# EasyEDA schematic dldpad_schematic.json
TITLE: Sheet_1; REV: 1.0; Date: 2025-02-01; Sheet: 1/1; Drawn By: tabletonly28; Company: Your Company
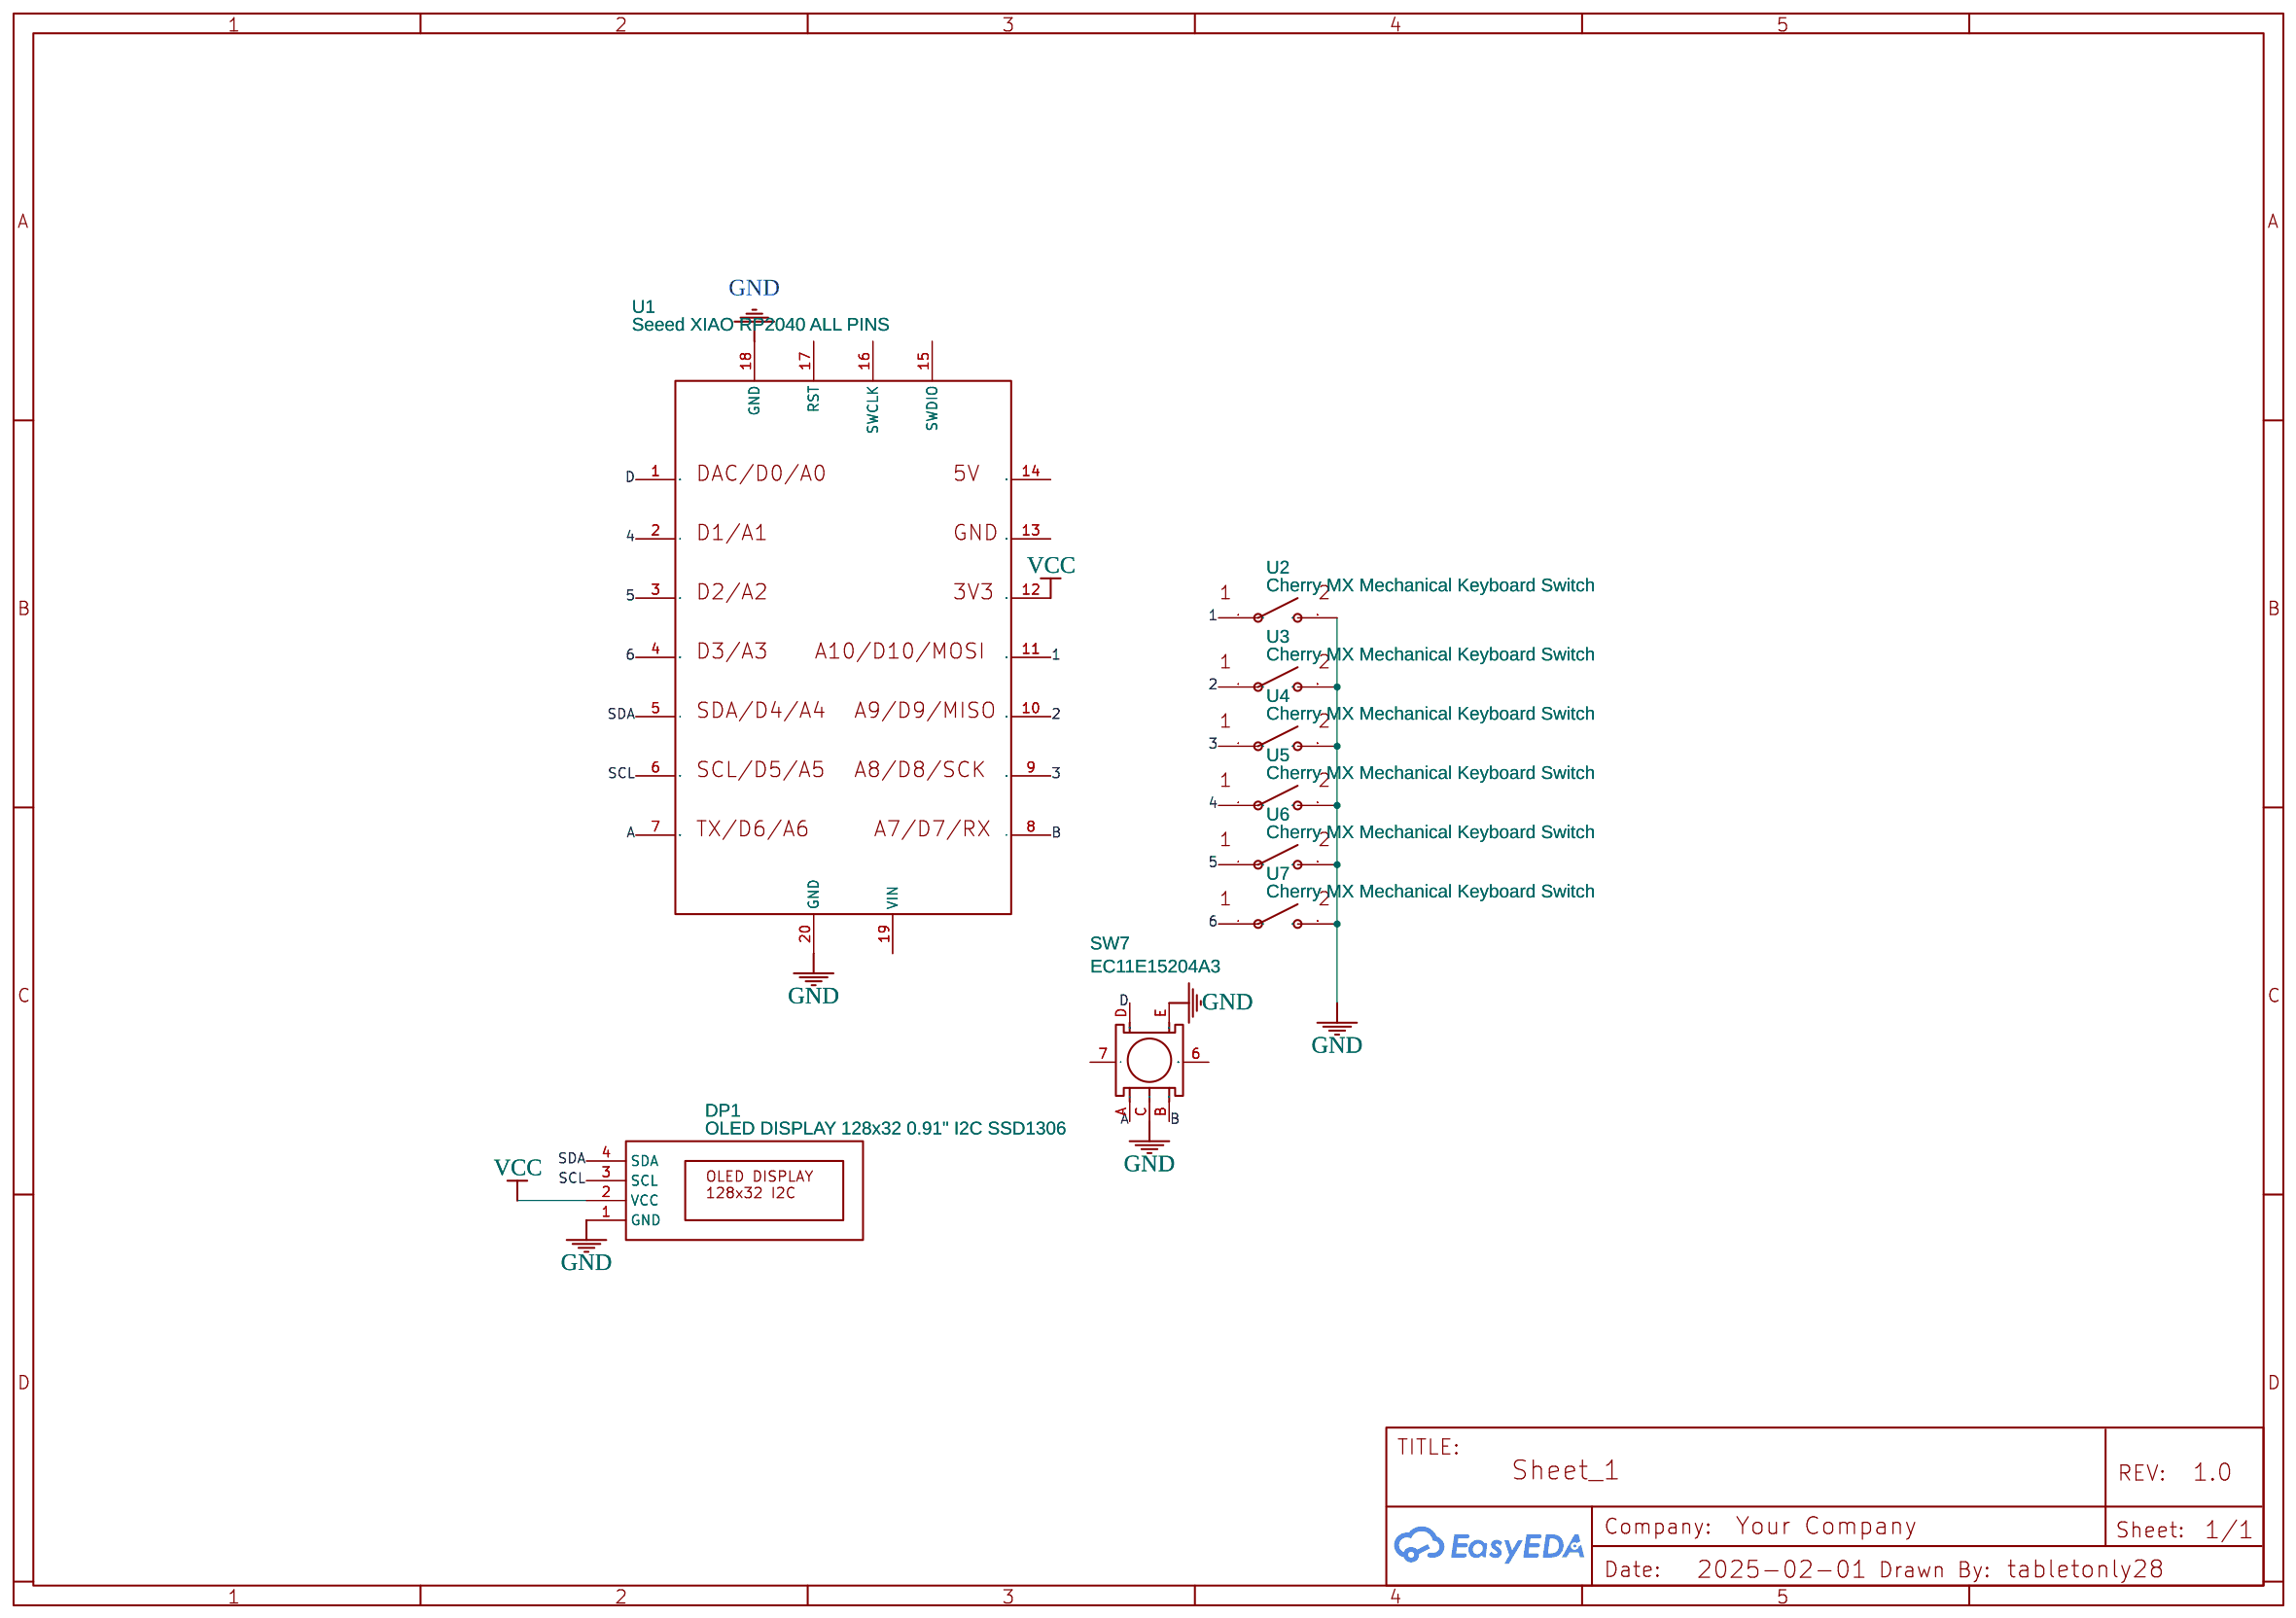
[diagram p0: schematic sheet]

## Parts
DP1  OLED DISPLAY 128x32 0.91" I2C SSD1306  [OLED-TH-C128-R64-D0.91-I2C-SSD1306]
SW7  EC11E15204A3  [SW-TH_EC11XXXXXXXX]
U1  Seeed XIAO RP2040 ALL PINS  [SEEED XIAO RP2040]
U2  Cherry MX Mechanical Keyboard Switch  [CHERRY MX KEYSWITCH]
U3  Cherry MX Mechanical Keyboard Switch  [CHERRY MX KEYSWITCH]
U4  Cherry MX Mechanical Keyboard Switch  [CHERRY MX KEYSWITCH]
U5  Cherry MX Mechanical Keyboard Switch  [CHERRY MX KEYSWITCH]
U6  Cherry MX Mechanical Keyboard Switch  [CHERRY MX KEYSWITCH]
U7  Cherry MX Mechanical Keyboard Switch  [CHERRY MX KEYSWITCH]

## Library data of the parts
DP1 = OLED DISPLAY 128x32 0.91" I2C SSD1306: Contributor: durandal
SW7 = EC11E15204A3: Contributor: LCSC; Supplier: LCSC; Supplier Part: C470710; Manufacturer: ALPSALPINE(阿尔卑斯阿尔派); JLCPCB Part Class: Extended Part
U1 = Seeed XIAO RP2040 ALL PINS: Manufacturer: Seeedstudio; Manufacturer Part: 102010328; link: https://www.seeedstudio.com/Seeeduino-XIAO-Arduino-Microcontroller-SAMD21-Cortex-M0+-p-4426.html; Contributor: Derick2k
U2-U7 = Cherry MX Mechanical Keyboard Switch: Contributor: aaronszm

## Nets
GND: DP1.1(GND) SW7.C SW7.E U1.18(GND) U1.20(GND) U2.2 U3.2 U4.2 U5.2 U6.2 U7.2
VCC: DP1.2(VCC) U1.12(11)
1: U1.11(10) U2.1
2: U1.10(9) U3.1
3: U1.9(8) U4.1
4: U1.2(1) U5.1
5: U1.3(2) U6.1
6: U1.4(3) U7.1
A: SW7.A U1.7(6)
B: SW7.B U1.8(7)
D: SW7.D U1.1(0)
SCL: DP1.3(SCL) U1.6(5)
SDA: DP1.4(SDA) U1.5(4)

Not connected (* = marked no-connect by the designer): SW7 6 7; U1 13(12) 14(13) 15(SWDIO) 16(SWCLK) 17(RST) 19(VIN)
